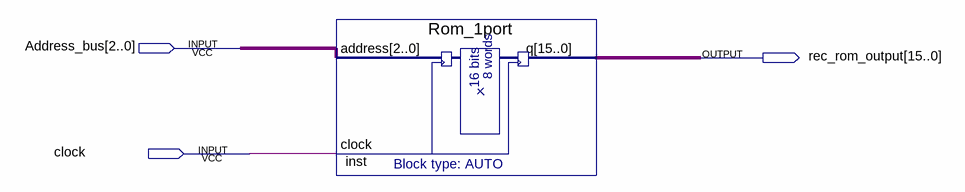
[diagram p0: schematic sheet]
// Quartus schematic Rom_1port_tanh.bdf as structural Verilog: 1 symbols, 3 pins
module Rom_1port_tanh (
  input  [2:0] Address_bus,
  input  clock,
  output [15:0] rec_rom_output
);

  Rom_1port inst (.address(Address_bus), .clock(clock), .q(rec_rom_output));
endmodule
